# Altium schematic sheet 模块&电源.SchDoc
size A4; SheetNumber: 2; SheetTotal: 3
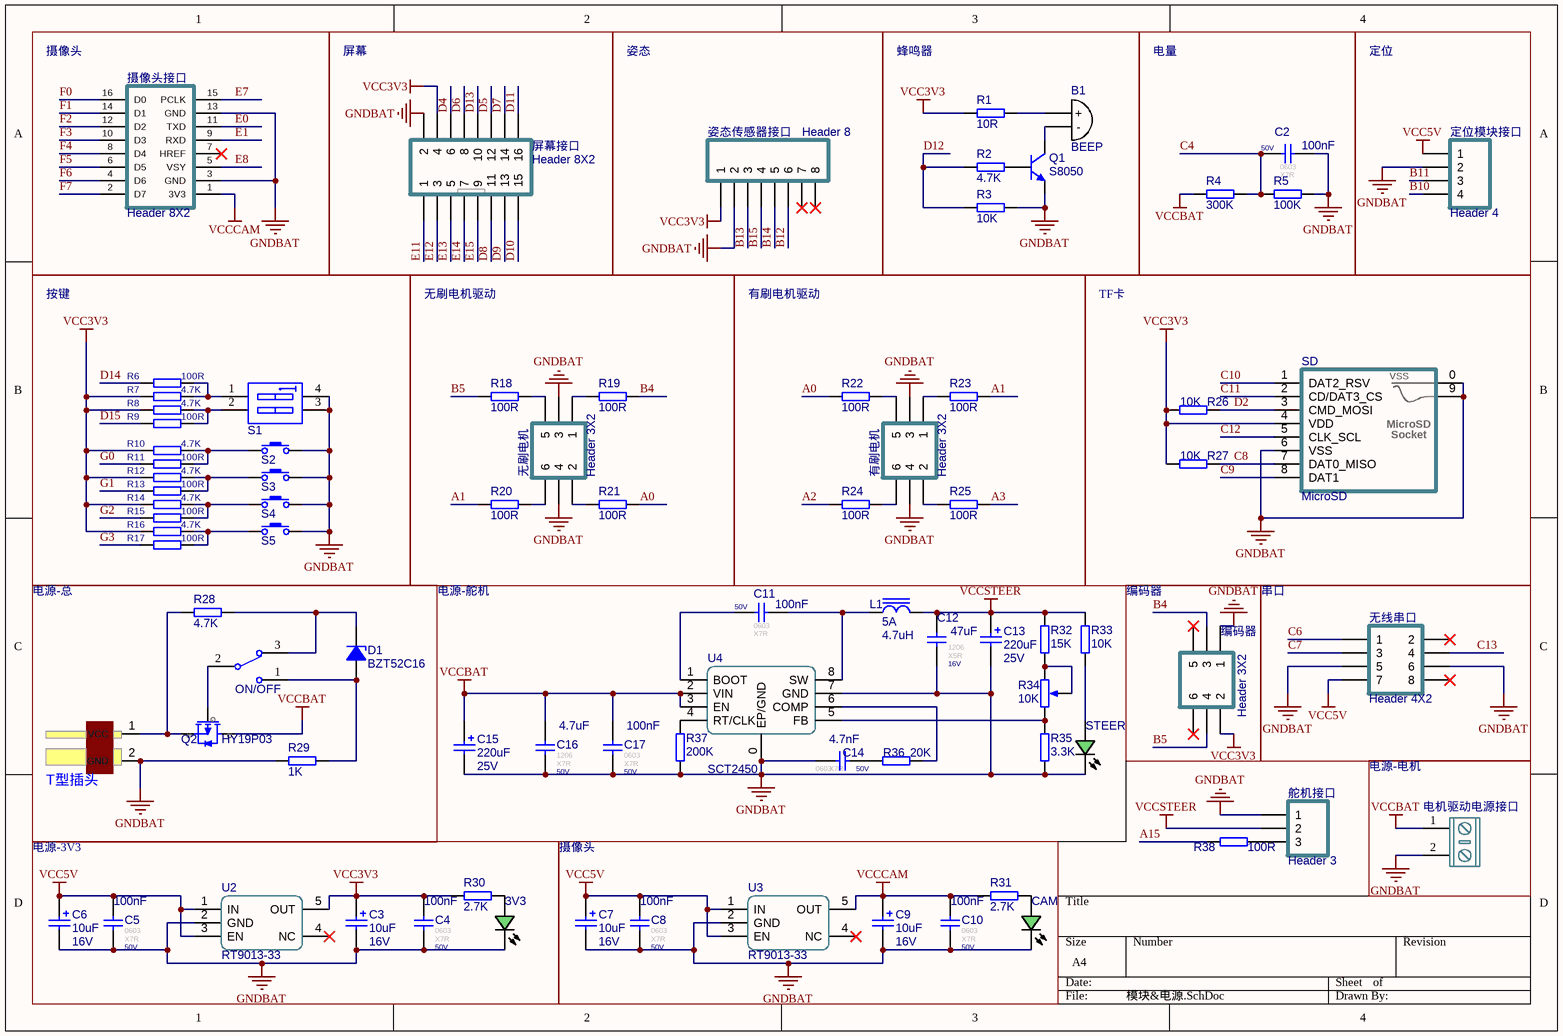
[diagram p0: 模块&电源.SchDoc]

## Parts
3V3  翠绿贴片LED  [LEDC1608(0603)-L]  (value not drawn)
B1  BEEP  [BEEP 9x5.5mm]
C2  value 100nF  Footprint: 0603  Type: X7R  Voltage: 50V  [CAPC3216[1206]S]  (hidden comment: 100nF ±10% 50V)
C3  value 10uF  Voltage: 16V  [CAPT3216]  (hidden comment: 10uF 16V)
C4  value 100nF  Footprint: 0603  Type: X7R  Voltage: 50V  [CAPC3216[1206]S]  (hidden comment: 100nF ±10% 50V)
C5  value 100nF  Footprint: 0603  Type: X7R  Voltage: 50V  [CAPC3216[1206]S]  (hidden comment: 100nF ±10% 50V)
C6  value 10uF  Voltage: 16V  [CAPT3216]  (hidden comment: 10uF 16V)
C7  value 10uF  Voltage: 16V  [CAPT3216]  (hidden comment: 10uF 16V)
C8  value 100nF  Footprint: 0603  Type: X7R  Voltage: 50V  [CAPC3216[1206]S]  (hidden comment: 100nF ±10% 50V)
C9  value 10uF  Voltage: 16V  [CAPT3216]  (hidden comment: 10uF 16V)
C10  value 100nF  Footprint: 0603  Type: X7R  Voltage: 50V  [CAPC3216[1206]S]  (hidden comment: 100nF ±10% 50V)
C11  value 100nF  Footprint: 0603  Type: X7R  Voltage: 50V  [CAPC3216[1206]S]  (hidden comment: 100nF ±10% 50V)
C12  value 47uF  Footprint: 1206  Type: X5R  Voltage: 16V  [CAPC3216[1206]S]  (hidden comment: 47uF ±10% 16V)
C13  value 220uF  Voltage: 25V  [CAPS6.3]  (hidden comment: 220uF 25V)
C14  value 4.7nF  Footprint: 0603  Type: X7R  Voltage: 50V  [CAPC3216[1206]S]  (hidden comment: 4.7nF ±10% 50V)
C15  value 220uF  Voltage: 25V  [CAPS6.3]  (hidden comment: 220uF 25V)
C16  value 4.7uF  Footprint: 1206  Type: X7R  Voltage: 50V  [CAPC3216[1206]S]  (hidden comment: 4.7uF ±10% 50V)
C17  value 100nF  Footprint: 0603  Type: X7R  Voltage: 50V  [CAPC3216[1206]S]  (hidden comment: 100nF ±10% 50V)
CAM  翠绿贴片LED  [LEDC1608(0603)-L]  (value not drawn)
D1  BZT52C16  [SOD-123-L]
DCIN?  T型插头  [Wired T-Header ThroughHole]
L1  value 4.7uH  Imax: 5A  [0630 TPC 7*7*3]  (hidden comment: 4.7uH 5A)
ON/OFF  SW-SPDT  [SS12D10]  (value not drawn)
Q1  S8050  [SOT-23]
Q2  HY19P03  [TO-252AA]
R1  value 10R  [RESC1608[0603]S-N]  (hidden comment: 10R ±1%)
R2  value 4.7K  [RESC1608[0603]S-N]  (hidden comment: 4.7K ±1%)
R3  value 10K  [RESC1608[0603]S-N]  (hidden comment: 10K ±1%)
R4  value 300K  [RESC1608[0603]S-N]  (hidden comment: 300K ±1%)
R5  value 100K  [RESC1608[0603]S-N]  (hidden comment: 100K ±1%)
R6  value 100R  [RESC1608[0603]S-N]  (hidden comment: 100R ±1%)
R7  value 4.7K  [RESC1608[0603]S-N]  (hidden comment: 4.7K ±1%)
R8  value 4.7K  [RESC1608[0603]S-N]  (hidden comment: 4.7K ±1%)
R9  value 100R  [RESC1608[0603]S-N]  (hidden comment: 100R ±1%)
R10  value 4.7K  [RESC1608[0603]S-N]  (hidden comment: 4.7K ±1%)
R11  value 100R  [RESC1608[0603]S-N]  (hidden comment: 100R ±1%)
R12  value 4.7K  [RESC1608[0603]S-N]  (hidden comment: 4.7K ±1%)
R13  value 100R  [RESC1608[0603]S-N]  (hidden comment: 100R ±1%)
R14  value 4.7K  [RESC1608[0603]S-N]  (hidden comment: 4.7K ±1%)
R15  value 100R  [RESC1608[0603]S-N]  (hidden comment: 100R ±1%)
R16  value 4.7K  [RESC1608[0603]S-N]  (hidden comment: 4.7K ±1%)
R17  value 100R  [RESC1608[0603]S-N]  (hidden comment: 100R ±1%)
R18  value 100R  [RESC1608[0603]S-N]  (hidden comment: 100R ±1%)
R19  value 100R  [RESC1608[0603]S-N]  (hidden comment: 100R ±1%)
R20  value 100R  [RESC1608[0603]S-N]  (hidden comment: 100R ±1%)
R21  value 100R  [RESC1608[0603]S-N]  (hidden comment: 100R ±1%)
R22  value 100R  [RESC1608[0603]S-N]  (hidden comment: 100R ±1%)
R23  value 100R  [RESC1608[0603]S-N]  (hidden comment: 100R ±1%)
R24  value 100R  [RESC1608[0603]S-N]  (hidden comment: 100R ±1%)
R25  value 100R  [RESC1608[0603]S-N]  (hidden comment: 100R ±1%)
R26  value 10K  [RESC1608[0603]S-N]  (hidden comment: 10K ±1%)
R27  value 10K  [RESC1608[0603]S-N]  (hidden comment: 10K ±1%)
R28  value 4.7K  [RESC1608[0603]S-N]  (hidden comment: 4.7K ±1%)
R29  value 1K  [RESC1608[0603]S-N]  (hidden comment: 1K ±1%)
R30  value 2.7K  [RESC1608[0603]S-N]  (hidden comment: 2.7K ±1%)
R31  value 2.7K  [RESC1608[0603]S-N]  (hidden comment: 2.7K ±1%)
R32  value 15K  [RESC1608[0603]S-N]  (hidden comment: 15K ±1%)
R33  value 10K  [RESC1608[0603]S-N]  (hidden comment: 10K ±1%)
R34  10K  [RESPOT3296]
R35  value 3.3K  [RESC1608[0603]S-N]  (hidden comment: 3.3K ±1%)
R36  value 20K  [RESC1608[0603]S-N]  (hidden comment: 20K ±1%)
R37  value 200K  [RESC1608[0603]S-N]  (hidden comment: 200K ±1%)
R38  value 100R  [RESC1608[0603]S-N]  (hidden comment: 100R ±1%)
S1  SW DIP-2  [Code SW-2-DIP-2.54]  (value not drawn)
S2  Button  [PTS810-3*4-CurvePin]  (value not drawn)
S3  Button  [PTS810-3*4-CurvePin]  (value not drawn)
S4  Button  [PTS810-3*4-CurvePin]  (value not drawn)
S5  Button  [PTS810-3*4-CurvePin]  (value not drawn)
SD  MicroSD  [TF-001]
STEER  翠绿贴片LED  [LEDC1608(0603)-L]  (value not drawn)
U2  RT9013-33  [SOT-23-5]
U3  RT9013-33  [SOT-23-5]
U4  SCT2450  [SOP-8E]
姿态传感器接口  Header 8  [HDR1X8]
定位模块接口  Header 4  [HDR1X4]
屏幕接口  Header 8X2  [HDR2X8-F-High]
摄像头接口  Header 8X2  [Cam_HDR2X8-F-SMT]
无刷电机  Header 3X2  [HDR2X3-M-SMT]
无线串口  Header 4X2  [HDR2X4-F-SMT]
有刷电机  Header 3X2  [HDR2X3-M-SMT]
电机驱动电源接口  KF/WJ/DG 30x connecter  [KF/WJ/DG 301-2p-5.0mm]  (value not drawn)
编码器  Header 3X2  [HDR2X3-M-SMT]
舵机接口  Header 3  [HDR1X3]

## Blocks framed on the sheet
摄像头: 摄像头接口
屏幕: 屏幕接口
姿态: 姿态传感器接口
蜂鸣器: B1 Q1 R1-R3
电量: C2 R4 R5
定位: 定位模块接口
按键: R6-R17 S1-S5
无刷电机驱动: R18-R21 无刷电机
有刷电机驱动: R22-R25 有刷电机
TF卡: R26 R27 SD
电源-总: D1 DCIN? ON/OFF Q2 R28 R29
编码器: 编码器
串口: 无线串口
电源-电机: 电机驱动电源接口
电源-3V3: 3V3 C3-C6 R30 U2
摄像头: C7-C10 CAM R31 U3

## Nets
GNDBAT: 3V3.C C2.2 C3.2 C4.2 C5.2 C6.2 C7.2 C8.2 C9.2 C10.2 C12.1 C13.2 C14.1 C15.2 C16.1 C17.1 CAM.C DCIN?.2(GND) Q1.2(E) R3.2 R5.2 R29.1 R35.2 R37.1 S1.3(B2) S1.4(B1) S2.1 S3.1 S4.1 S5.1 SD.0(GND) SD.6(VSS) SD.9 STEER.C U2.2(GND) U3.2(GND) U4.0(EP/GND) U4.7(GND) 姿态传感器接口.2 定位模块接口.2 屏幕接口.2 摄像头接口.3(GND) 摄像头接口.13(GND) 无刷电机.3 无刷电机.4 无线串口.5 无线串口.6 有刷电机.3 有刷电机.4 电机驱动电源接口.2 编码器.1 舵机接口.1
VCC3V3: C3.1 C4.1 R1.1 R7.1 R8.1 R10.1 R12.1 R14.1 R16.1 R26.1 R27.1 R30.1 SD.4(VDD) U2.5(OUT) 姿态传感器接口.1 屏幕接口.4 编码器.2
VCC5V: C5.1 C6.1 C7.1 C8.1 U2.1(IN) U2.3(EN) U3.1(IN) U3.3(EN) 定位模块接口.1 无线串口.7
VCCBAT: C15.1 C16.2 C17.2 Q2.1(D) R4.1 U4.2(VIN) U4.3(EN) 电机驱动电源接口.1
VCCCAM: C9.1 C10.1 R31.1 U3.5(OUT) 摄像头接口.1(3V3)
VCCSTEER: C12.2 C13.1 L1.2 R32.1 R33.1 舵机接口.2
A0: R21.2 R22.1
A1: R20.1 R23.2
A2: R24.1
A3: R25.2
A15: R38.1
B4: R19.2 编码器.3
B5: R18.1 编码器.4
B10: 定位模块接口.4
B11: 定位模块接口.3
B12: 姿态传感器接口.6
B13: 姿态传感器接口.3
B14: 姿态传感器接口.5
B15: 姿态传感器接口.4
C4: C2.1 R4.2 R5.1
C6: 无线串口.1
C7: 无线串口.3
C8: R27.2 SD.7(DAT0_MISO)
C9: SD.8(DAT1)
C10: SD.1(DAT2_RSV)
C11: SD.2(CD/DAT3_CS)
C12: SD.5(CLK_SCL)
C13: 无线串口.4
D2: R26.2 SD.3(CMD_MOSI)
D4: 屏幕接口.6
D5: 屏幕接口.12
D6: 屏幕接口.8
D7: 屏幕接口.14
D8: 屏幕接口.11
D9: 屏幕接口.13
D10: 屏幕接口.15
D11: 屏幕接口.16
D12: R2.1 R3.1
D13: 屏幕接口.10
D14: R6.1
D15: R9.1
E0: 摄像头接口.11(TXD)
E1: 摄像头接口.9(RXD)
E7: 摄像头接口.15(PCLK)
E8: 摄像头接口.5(VSY)
E11: 屏幕接口.1
E12: 屏幕接口.3
E13: 屏幕接口.5
E14: 屏幕接口.7
E15: 屏幕接口.9
F0: 摄像头接口.16(D0)
F1: 摄像头接口.14(D1)
F2: 摄像头接口.12(D2)
F3: 摄像头接口.10(D3)
F4: 摄像头接口.8(D4)
F5: 摄像头接口.6(D5)
F6: 摄像头接口.4(D6)
F7: 摄像头接口.2(D7)
G0: R11.1
G1: R13.1
G2: R15.1
G3: R17.1
Net3V3_A: 3V3.A R30.2
NetB1_1: B1.1(+) R1.2
NetB1_2: B1.2(-) Q1.3(C)
NetC11_1: C11.1 U4.1(BOOT)
NetC11_2: C11.2 L1.1 U4.8(SW)
NetC14_2: C14.2 R36.1
NetCAM_A: CAM.A R31.2
NetD1_A: D1.A ON/OFF.1 R29.2
NetD1_K: D1.K ON/OFF.3 R28.1
NetDCIN?_1: DCIN?.1(VCC) Q2.3(S) R28.2
NetON/OFF_2: ON/OFF.2 Q2.2(G)
NetQ1_1: Q1.1(B) R2.2
NetR6_2: R6.2 R7.2 S1.1(A1)
NetR8_2: R8.2 R9.2 S1.2(A2)
NetR10_2: R10.2 R11.2 S2.2
NetR12_2: R12.2 R13.2 S3.2
NetR14_2: R14.2 R15.2 S4.2
NetR16_2: R16.2 R17.2 S5.2
NetR18_2: R18.2 无刷电机.5
NetR19_1: R19.1 无刷电机.1
NetR20_2: R20.2 无刷电机.6
NetR21_1: R21.1 无刷电机.2
NetR22_2: R22.2 有刷电机.5
NetR23_1: R23.1 有刷电机.1
NetR24_2: R24.2 有刷电机.6
NetR25_1: R25.1 有刷电机.2
NetR32_2: R32.2 R34.2(BOT) R34.ADJ
NetR33_2: R33.2 STEER.A
NetR34_1: R34.1(TOP) R35.1 U4.5(FB)
NetR36_2: R36.2 U4.6(COMP)
NetR37_2: R37.2 U4.4(RT/CLK)
NetR38_2: R38.2 舵机接口.3

Not connected (* = marked no-connect by the designer): U2 4(NC)*; U3 4(NC)*; 姿态传感器接口 7* 8*; 摄像头接口 7(HREF)*; 无线串口 2* 8*; 编码器 5* 6*

## Notes on the sheet
- 电源-舵机
- (in symbol MicroSD_TF001A) Socket

## Library data of the parts
3V3 CAM STEER = LED Chip Green: Published: 8-Jun-2000; Revision: July-2002: Re-released for DXP Platform.; Publisher: Altium Limited; Price(RMB): 0.00
B1 = BEEP: 蜂鸣器
C2 C4 C5 C8 C10 C11 C17 = Cap-Chip_2: 贴片电容; Published: 2021-12-13; Revision: V1.2; Tolerance: ±10%
C3 C6 C7 C9 = Cap-Tan_1: Tantalum Capacitor; Published: 8-Jun-2000; Revision: July-2002: Re-released for DXP Platform.; Publisher: Altium Limited; Price(RMB): 0.000
C12 = Cap-Chip_1: 贴片电容; Published: 2021-12-13; Revision: V1.2; Tolerance: ±10%
C13 C15 = Cap-Solid: Polarized Capacitor (Radial); Published: 8-Jun-2000; Revision: July-2002: Re-released for DXP Platform.; Publisher: Altium Limited; Price(RMB): 0.000
C14 = Cap-Chip: 贴片电容; Published: 2021-12-13; Revision: V1.2; Tolerance: ±10%
C16 = Cap-Chip_3: 贴片电容; Published: 2021-12-13; Revision: V1.2; Tolerance: ±10%
D1 = Diode Zen: 稳压二极管 齐纳二极管  Zener Diode; Published: 8-Jun-2000; Revision: July-2002: Re-released for DXP Platform.; Publisher: Altium Limited; Price(RMB): 0.000
DCIN? = T_Header
L1 = Ind-Power: 功率电感; DCR: .5m; Published: 8-Jun-2000; Revision: July-2002: Re-released for DXP Platform.; Publisher: Altium Limited; Price(RMB): 0.000
ON/OFF = SW-SPDT: 单刀双掷开关 3脚船型、钮子、拨动开关 SPDT Subminiature Toggle Switch; Published: 24-Mar-1999; Publisher: Altium Limited; Price(RMB): 0.000
Q1 = NPN S8050: Discrete NPN Bipolar Transistor; Published: 8-Jun-2000; Revision: July-2002: Re-released for DXP Platform.; Publisher: Altium Limited; Price(RMB): 0.000; PartNumber: S8050
Q2 = HY19P03: HY19P03 P-Channel MOSFET
R1 = Res-Chip_13: 贴片电阻; Published: 8-Jun-2000; Revision: July-2002: Re-released for DXP Platform.; Tolerance: ±1%
R2 R7 R8 R10 R12 R14 R16 R28 = Res-Chip_5: 贴片电阻; Published: 8-Jun-2000; Revision: July-2002: Re-released for DXP Platform.; Tolerance: ±1%
R3 R26 R27 R33 = Res-Chip_3: 贴片电阻; Published: 8-Jun-2000; Revision: July-2002: Re-released for DXP Platform.; Tolerance: ±1%
R4 = Res-Chip_11: 贴片电阻; Published: 8-Jun-2000; Revision: July-2002: Re-released for DXP Platform.; Tolerance: ±1%
R5 = Res-Chip_12: 贴片电阻; Published: 8-Jun-2000; Revision: July-2002: Re-released for DXP Platform.; Tolerance: ±1%
R6 R9 R11 R13 R15 R17-R25 R38 = Res-Chip_8: 贴片电阻; Published: 8-Jun-2000; Revision: July-2002: Re-released for DXP Platform.; Tolerance: ±1%
R29 = Res-Chip_10: 贴片电阻; Published: 8-Jun-2000; Revision: July-2002: Re-released for DXP Platform.; Tolerance: ±1%
R30 R31 = Res-Chip_9: 贴片电阻; Published: 8-Jun-2000; Revision: July-2002: Re-released for DXP Platform.; Tolerance: ±1%
R32 = Res-Chip_6: 贴片电阻; Published: 8-Jun-2000; Revision: July-2002: Re-released for DXP Platform.; Tolerance: ±1%
R34 = Res-Adj-3p: 可调电阻; Value: 10K
R35 = Res-Chip_7: 贴片电阻; Published: 8-Jun-2000; Revision: July-2002: Re-released for DXP Platform.; Tolerance: ±1%
R36 = Res-Chip_1: 贴片电阻; Published: 8-Jun-2000; Revision: July-2002: Re-released for DXP Platform.; Tolerance: ±1%
R37 = Res-Chip: 贴片电阻; Published: 8-Jun-2000; Revision: July-2002: Re-released for DXP Platform.; Tolerance: ±1%
S1 = Code SW-2: 2位拨码开关; Published: 24-Mar-1999; Revision: July-2002: Re-released for DXP Platform.; Publisher: Altium Limited; Price(RMB): 0.000
S2-S5 = KEY: 按键; Published: 24-Mar-1999; Publisher: Altium Limited; Price(RMB): 0.000
SD = MicroSD_TF001A: 星坤 KXTF-001
U2 U3 = RT9013-33: 3.3V 500mA SOT-23-5 LDO
U4 = SCT2450: 3.8V-36V Vin, 5A, High Efficiency Synchronous Step-down DCDC Converter / with Programmable Frequency
姿态传感器接口 = Header 8: Header, 8-Pin; LatestRevisionDate: 17-Jul-2002; LatestRevisionNote: Re-released for DXP Platform.; Publisher: Altium Limited; Price(RMB): 0.00
定位模块接口 = Header 4: Header, 4-Pin; LatestRevisionDate: 17-Jul-2002; LatestRevisionNote: Re-released for DXP Platform.; Publisher: Altium Limited; Price(RMB): 0.00
屏幕接口 = Header 8X2: Header, 8-Pin, Dual row; LatestRevisionDate: 17-Jul-2002; LatestRevisionNote: Re-released for DXP Platform.; Publisher: Altium Limited; Price(RMB): 0.00
摄像头接口 = Camera Interface: 摄像头转接板接口 2x8 双排座; LatestRevisionDate: 17-Jul-2002; LatestRevisionNote: Re-released for DXP Platform.; Publisher: Altium Limited; Price(RMB): 0.00
无刷电机 有刷电机 编码器 = Header 3X2: Header, 3-Pin, Dual row; LatestRevisionDate: 17-Jul-2002; LatestRevisionNote: Re-released for DXP Platform.; Publisher: Altium Limited; Price(RMB): 0.00
无线串口 = Header 4X2: Header, 4-Pin, Dual row; LatestRevisionDate: 17-Jul-2002; LatestRevisionNote: Re-released for DXP Platform.; Publisher: Altium Limited; Price(RMB): 0.00
电机驱动电源接口 = KF/WJ/DG 30x: 接线端子 2Pin
舵机接口 = Header 3: Header, 3-Pin; LatestRevisionDate: 17-Jul-2002; LatestRevisionNote: Re-released for DXP Platform.; Publisher: Altium Limited; Price(RMB): 0.00